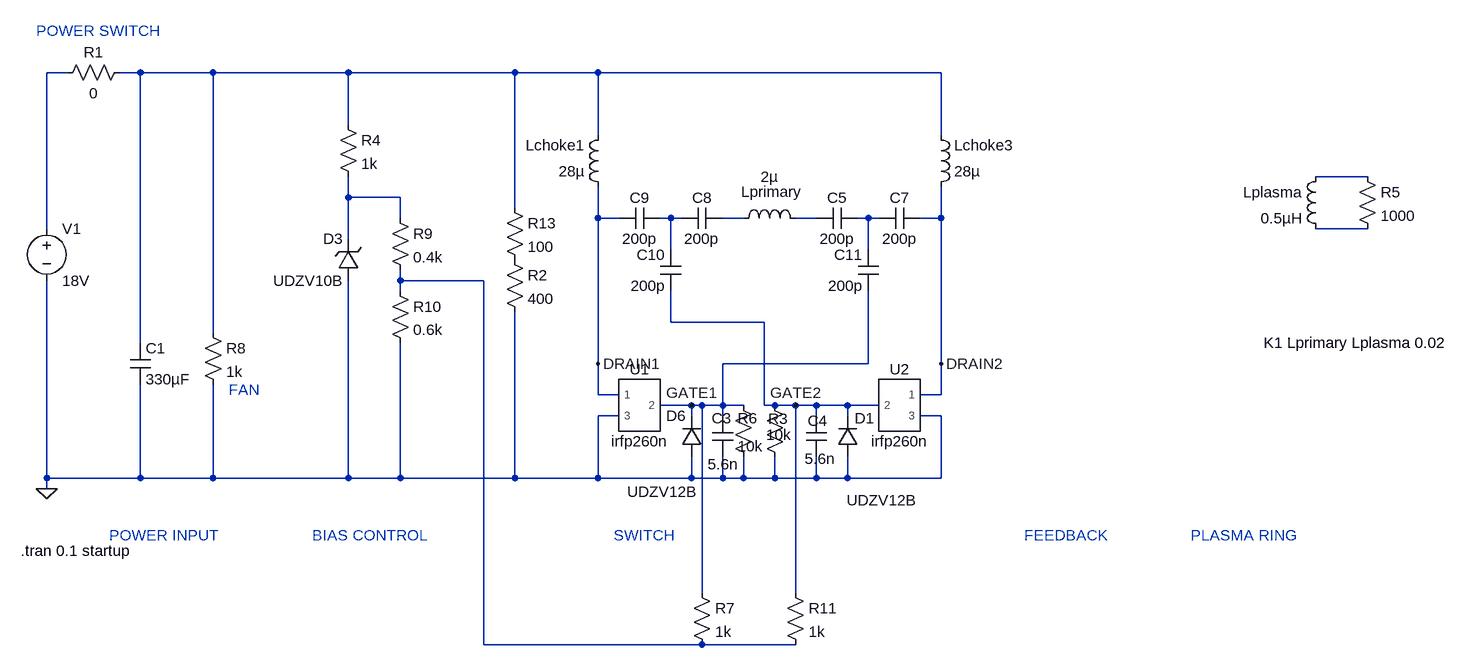
[diagram p0: schematic DualFETZVS-Willis.asc]
DualFETZVS-Willis.asc, the LTspice schematic file:
Version 4.1
SHEET 1 2388 680
WIRE 128 -432 96 -432
WIRE 240 -432 208 -432
WIRE 352 -432 240 -432
WIRE 560 -432 352 -432
WIRE 816 -432 560 -432
WIRE 944 -432 816 -432
WIRE 1472 -432 944 -432
WIRE 560 -352 560 -432
WIRE 944 -336 944 -432
WIRE 1472 -336 1472 -432
WIRE 2128 -272 2048 -272
WIRE 560 -240 560 -272
WIRE 640 -240 560 -240
WIRE 816 -224 816 -432
WIRE 640 -208 640 -240
WIRE 944 -208 944 -256
WIRE 976 -208 944 -208
WIRE 1056 -208 1040 -208
WIRE 1072 -208 1056 -208
WIRE 1168 -208 1136 -208
WIRE 1280 -208 1248 -208
WIRE 1360 -208 1344 -208
WIRE 1376 -208 1360 -208
WIRE 1472 -208 1472 -256
WIRE 1472 -208 1440 -208
WIRE 96 -192 96 -432
WIRE 2128 -192 2048 -192
WIRE 560 -176 560 -240
WIRE 1056 -160 1056 -208
WIRE 1360 -160 1360 -208
WIRE 640 -112 640 -128
WIRE 768 -112 640 -112
WIRE 640 -96 640 -112
WIRE 1056 -48 1056 -96
WIRE 1200 -48 1056 -48
WIRE 352 -32 352 -432
WIRE 240 -16 240 -432
WIRE 944 16 944 -208
WIRE 1360 16 1360 -96
WIRE 1360 16 1136 16
WIRE 1472 16 1472 -208
WIRE 944 64 944 16
WIRE 976 64 944 64
WIRE 1472 64 1472 16
WIRE 1472 64 1440 64
WIRE 1088 80 1040 80
WIRE 1104 80 1088 80
WIRE 1136 80 1136 16
WIRE 1136 80 1104 80
WIRE 1168 80 1136 80
WIRE 1200 80 1200 -48
WIRE 1216 80 1200 80
WIRE 1248 80 1216 80
WIRE 1280 80 1248 80
WIRE 1328 80 1280 80
WIRE 1376 80 1328 80
WIRE 976 96 944 96
WIRE 1088 96 1088 80
WIRE 1136 96 1136 80
WIRE 1280 96 1280 80
WIRE 1328 96 1328 80
WIRE 1472 96 1440 96
WIRE 96 192 96 -112
WIRE 240 192 240 48
WIRE 240 192 96 192
WIRE 352 192 352 48
WIRE 352 192 240 192
WIRE 560 192 560 -112
WIRE 560 192 352 192
WIRE 640 192 640 -16
WIRE 640 192 560 192
WIRE 816 192 816 -64
WIRE 816 192 640 192
WIRE 944 192 944 96
WIRE 944 192 816 192
WIRE 1088 192 1088 160
WIRE 1088 192 944 192
WIRE 1136 192 1136 160
WIRE 1136 192 1088 192
WIRE 1168 192 1168 160
WIRE 1168 192 1136 192
WIRE 1216 192 1216 160
WIRE 1216 192 1168 192
WIRE 1280 192 1280 160
WIRE 1280 192 1216 192
WIRE 1328 192 1328 160
WIRE 1328 192 1280 192
WIRE 1472 192 1472 96
WIRE 1472 192 1328 192
WIRE 96 208 96 192
WIRE 1104 368 1104 80
WIRE 1248 368 1248 80
WIRE 768 448 768 -112
WIRE 1104 448 768 448
WIRE 1248 448 1104 448
FLAG 96 208 0
FLAG 1088 80 GATE1
FLAG 944 16 DRAIN1
FLAG 1248 80 GATE2
FLAG 1472 16 DRAIN2
SYMBOL voltage 96 -208 R0
WINDOW 123 0 0 Left 0
WINDOW 39 0 0 Left 0
SYMATTR InstName V1
SYMATTR Value 18V
SYMBOL res 224 -448 R90
WINDOW 0 0 56 VBottom 2
WINDOW 3 32 56 VTop 2
SYMATTR InstName R1
SYMATTR Value 0
SYMBOL cap 224 -16 R0
SYMATTR InstName C1
SYMATTR Value 330µF
SYMBOL ind 1152 -192 R270
WINDOW 0 41 60 VTop 2
WINDOW 3 95 56 VBottom 2
SYMATTR InstName Lprimary
SYMATTR Value 2µ
SYMATTR SpiceLine Rser=16m
SYMBOL ind 2064 -288 M0
SYMATTR InstName Lplasma
SYMATTR Value 0.5µH
SYMBOL res 336 -48 R0
SYMATTR InstName R8
SYMATTR Value 1k
SYMBOL res 2112 -288 R0
SYMATTR InstName R5
SYMATTR Value 1000
SYMBOL irfp260n 1008 80 M0
SYMATTR InstName U1
SYMBOL ind 960 -240 R180
WINDOW 0 36 80 Left 2
WINDOW 3 36 40 Left 2
SYMATTR InstName Lchoke1
SYMATTR Value 28µ
SYMATTR SpiceLine Rser=16m
SYMBOL zener 576 -112 R180
WINDOW 0 24 64 Left 2
WINDOW 3 24 0 Left 2
SYMATTR InstName D3
SYMATTR Value UDZV10B
SYMBOL res 544 -368 R0
SYMATTR InstName R4
SYMATTR Value 1k
SYMBOL res 624 -224 R0
SYMATTR InstName R9
SYMATTR Value 0.4k
SYMBOL res 624 -112 R0
SYMATTR InstName R10
SYMATTR Value 0.6k
SYMBOL irfp260n 1408 80 R0
SYMATTR InstName U2
SYMBOL ind 1456 -240 M180
WINDOW 0 36 80 Left 2
WINDOW 3 36 40 Left 2
SYMATTR InstName Lchoke3
SYMATTR Value 28µ
SYMATTR SpiceLine Rser=16m
SYMBOL res 800 -240 R0
SYMATTR InstName R13
SYMATTR Value 100
SYMBOL diode 1104 160 R180
WINDOW 0 24 64 Left 2
WINDOW 3 7 -53 Left 2
SYMATTR InstName D6
SYMATTR Value UDZV12B
SYMBOL diode 1344 160 R180
WINDOW 0 -26 60 Left 2
WINDOW 3 -91 -66 Left 2
SYMATTR InstName D1
SYMATTR Value UDZV12B
SYMBOL cap 1120 96 R0
WINDOW 0 -1 4 Left 2
WINDOW 3 -7 75 Left 2
SYMATTR InstName C3
SYMATTR Value 5.6n
SYMBOL cap 1264 96 R0
WINDOW 0 3 8 Left 2
WINDOW 3 -2 66 Left 2
SYMATTR InstName C4
SYMATTR Value 5.6n
SYMBOL res 800 -160 R0
SYMATTR InstName R2
SYMATTR Value 400
SYMBOL cap 1344 -224 R90
WINDOW 0 0 32 VBottom 2
WINDOW 3 32 32 VTop 2
SYMATTR InstName C5
SYMATTR Value 200p
SYMBOL cap 1440 -224 R90
WINDOW 0 0 32 VBottom 2
WINDOW 3 32 32 VTop 2
SYMATTR InstName C7
SYMATTR Value 200p
SYMBOL cap 1136 -224 R90
WINDOW 0 0 32 VBottom 2
WINDOW 3 32 32 VTop 2
SYMATTR InstName C8
SYMATTR Value 200p
SYMBOL cap 1040 -224 R90
WINDOW 0 0 32 VBottom 2
WINDOW 3 32 32 VTop 2
SYMATTR InstName C9
SYMATTR Value 200p
SYMBOL cap 1072 -96 R180
WINDOW 0 24 56 Left 2
WINDOW 3 24 8 Left 2
SYMATTR InstName C10
SYMATTR Value 200p
SYMBOL cap 1376 -96 R180
WINDOW 0 24 56 Left 2
WINDOW 3 24 8 Left 2
SYMATTR InstName C11
SYMATTR Value 200p
SYMBOL res 1200 64 R0
WINDOW 0 6 37 Left 2
WINDOW 3 3 61 Left 2
SYMATTR InstName R3
SYMATTR Value 10k
SYMBOL res 1152 64 R0
WINDOW 0 7 36 Left 2
WINDOW 3 7 79 Left 2
SYMATTR InstName R6
SYMATTR Value 10k
SYMBOL res 1088 352 R0
SYMATTR InstName R7
SYMATTR Value 1k
SYMBOL res 1232 352 R0
SYMATTR InstName R11
SYMATTR Value 1k
TEXT 80 -496 Left 2 ;POWER SWITCH
TEXT 376 56 Left 2 ;FAN
TEXT 1968 -16 Left 2 !K1 Lprimary Lplasma 0.02
TEXT 1856 280 Left 2 ;PLASMA RING
TEXT 192 280 Left 2 ;POWER INPUT
TEXT 504 280 Left 2 ;BIAS CONTROL
TEXT 968 280 Left 2 ;SWITCH
TEXT 1600 280 Left 2 ;FEEDBACK
TEXT 56 304 Left 2 !.tran 0.1 startup

The netlist it stands for:
* DualFETZVS-Willis.asc
V1 N001 0 18V
R1 N002 N001 0
C1 N002 0 330µF
Lprimary N006 N007 2µ Rser=16m
Lplasma N003 N009 0.5µH
R8 N002 0 1k
R5 N003 N009 1000
X§U1 DRAIN1 GATE1 0 irfp260n  ; pins 1 2 3
Lchoke1 DRAIN1 N002 28µ Rser=16m
D3 0 N004 UDZV10B
R4 N002 N004 1k
R9 N004 N010 0.4k
R10 N010 0 0.6k
X§U2 DRAIN2 GATE2 0 irfp260n  ; pins 1 2 3
Lchoke3 DRAIN2 N002 28µ Rser=16m
R13 N002 P001 100
D6 0 GATE1 UDZV12B
D1 0 GATE2 UDZV12B
C3 GATE1 0 5.6n
C4 GATE2 0 5.6n
R2 P001 0 400
C5 N008 N007 200p
C7 DRAIN2 N008 200p
C8 N006 N005 200p
C9 N005 DRAIN1 200p
C10 GATE2 N005 200p
C11 GATE1 N008 200p
R3 GATE2 0 10k
R6 GATE1 0 10k
R7 GATE1 N010 1k
R11 GATE2 N010 1k
.model D D
.lib standard.dio
* POWER SWITCH
* FAN
K1 Lprimary Lplasma 0.02
* PLASMA RING
* POWER INPUT
* BIAS CONTROL
* SWITCH
* FEEDBACK
.tran 0.1 startup
.lib C:\Users\userl\Downloads\irfp260n.spi
.backanno
.end